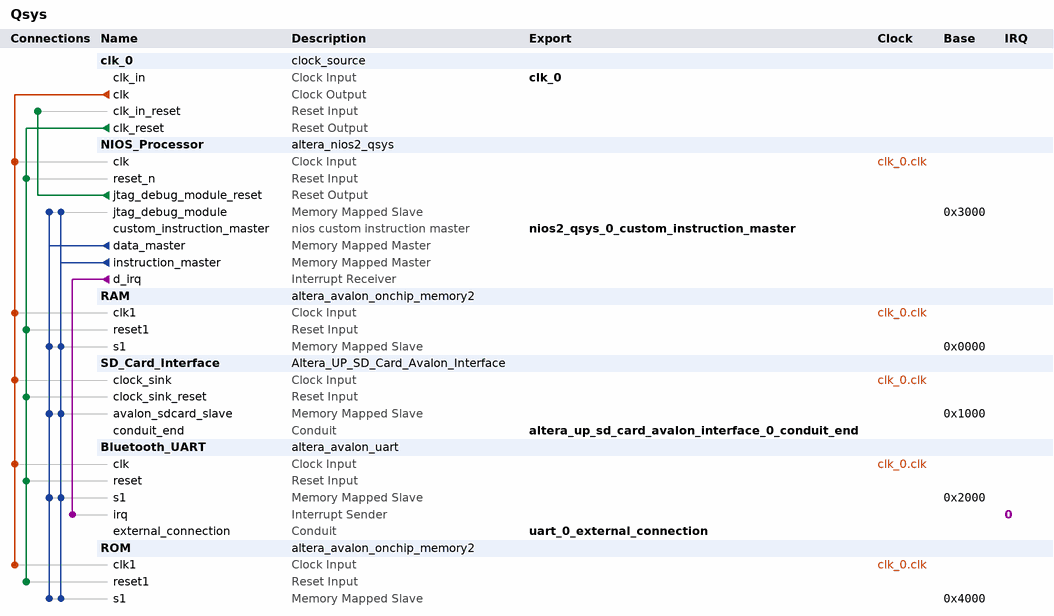
[diagram p0: system contents]
# Platform Designer (Qsys) system Qsys, Cyclone III EP3C25F256C6
# Parameters at their usual value, and those the tool derives, are not listed.
package require -exact qsys 13.0.1.99.2
create_system Qsys
set_project_property DEVICE_FAMILY {Cyclone III}
set_project_property DEVICE EP3C25F256C6

add_instance clk_0 clock_source 13.0
set_instance_parameter_value clk_0 clockFrequency 50000000

add_instance NIOS_Processor altera_nios2_qsys 13.0
set_instance_parameter_value NIOS_Processor setting_preciseIllegalMemAccessException true
set_instance_parameter_value NIOS_Processor setting_illegalInstructionsTrap true
set_instance_parameter_value NIOS_Processor setting_extraExceptionInfo true
set_instance_parameter_value NIOS_Processor resetSlave ROM.s1
set_instance_parameter_value NIOS_Processor mmu_TLBMissExcSlave None
set_instance_parameter_value NIOS_Processor exceptionSlave ROM.s1
set_instance_parameter_value NIOS_Processor breakSlave NIOS_Processor.jtag_debug_module
set_instance_parameter_value NIOS_Processor impl Small
set_instance_parameter_value NIOS_Processor icache_size 4096
set_instance_parameter_value NIOS_Processor debug_level Level2

add_instance RAM altera_avalon_onchip_memory2 13.0.1.99.2
set_instance_parameter_value RAM dataWidth 32
set_instance_parameter_value RAM dualPort false
set_instance_parameter_value RAM initMemContent true
set_instance_parameter_value RAM initializationFileName onchip_mem.hex
set_instance_parameter_value RAM memorySize 4096

add_instance SD_Card_Interface Altera_UP_SD_Card_Avalon_Interface 13.0

add_instance Bluetooth_UART altera_avalon_uart 13.0.1.99.2
set_instance_parameter_value Bluetooth_UART baud 19200
set_instance_parameter_value Bluetooth_UART dataBits 8
set_instance_parameter_value Bluetooth_UART fixedBaud true
set_instance_parameter_value Bluetooth_UART parity NONE
set_instance_parameter_value Bluetooth_UART stopBits 1

add_instance ROM altera_avalon_onchip_memory2 13.0.1.99.2
set_instance_parameter_value ROM dataWidth 32
set_instance_parameter_value ROM dualPort false
set_instance_parameter_value ROM initMemContent true
set_instance_parameter_value ROM initializationFileName onchip_mem.hex
set_instance_parameter_value ROM memorySize 4096
set_instance_parameter_value ROM writable false

# connections
add_connection clk_0.clk Bluetooth_UART.clk clock
add_connection clk_0.clk NIOS_Processor.clk clock
add_connection clk_0.clk RAM.clk1 clock
add_connection clk_0.clk ROM.clk1 clock
add_connection clk_0.clk SD_Card_Interface.clock_sink clock
add_connection clk_0.clk_reset Bluetooth_UART.reset reset
add_connection clk_0.clk_reset NIOS_Processor.reset_n reset
add_connection clk_0.clk_reset RAM.reset1 reset
add_connection clk_0.clk_reset ROM.reset1 reset
add_connection clk_0.clk_reset SD_Card_Interface.clock_sink_reset reset
add_connection NIOS_Processor.jtag_debug_module_reset clk_0.clk_in_reset reset
add_connection NIOS_Processor.data_master Bluetooth_UART.s1 avalon
set_connection_parameter_value NIOS_Processor.data_master/Bluetooth_UART.s1 baseAddress 0x2000
add_connection NIOS_Processor.data_master NIOS_Processor.jtag_debug_module avalon
set_connection_parameter_value NIOS_Processor.data_master/NIOS_Processor.jtag_debug_module baseAddress 0x3000
add_connection NIOS_Processor.data_master RAM.s1 avalon
set_connection_parameter_value NIOS_Processor.data_master/RAM.s1 baseAddress 0x0000
add_connection NIOS_Processor.data_master ROM.s1 avalon
set_connection_parameter_value NIOS_Processor.data_master/ROM.s1 baseAddress 0x4000
add_connection NIOS_Processor.data_master SD_Card_Interface.avalon_sdcard_slave avalon
set_connection_parameter_value NIOS_Processor.data_master/SD_Card_Interface.avalon_sdcard_slave baseAddress 0x1000
add_connection NIOS_Processor.instruction_master Bluetooth_UART.s1 avalon
set_connection_parameter_value NIOS_Processor.instruction_master/Bluetooth_UART.s1 baseAddress 0x2000
add_connection NIOS_Processor.instruction_master NIOS_Processor.jtag_debug_module avalon
set_connection_parameter_value NIOS_Processor.instruction_master/NIOS_Processor.jtag_debug_module baseAddress 0x3000
add_connection NIOS_Processor.instruction_master RAM.s1 avalon
set_connection_parameter_value NIOS_Processor.instruction_master/RAM.s1 baseAddress 0x0000
add_connection NIOS_Processor.instruction_master ROM.s1 avalon
set_connection_parameter_value NIOS_Processor.instruction_master/ROM.s1 baseAddress 0x4000
add_connection NIOS_Processor.instruction_master SD_Card_Interface.avalon_sdcard_slave avalon
set_connection_parameter_value NIOS_Processor.instruction_master/SD_Card_Interface.avalon_sdcard_slave baseAddress 0x1000
add_connection NIOS_Processor.d_irq Bluetooth_UART.irq interrupt
set_connection_parameter_value NIOS_Processor.d_irq/Bluetooth_UART.irq irqNumber 0

# exported interfaces
add_interface clk_0 clock sink
set_interface_property clk_0 EXPORT_OF clk_0.clk_in
add_interface nios2_qsys_0_custom_instruction_master nios_custom_instruction start
set_interface_property nios2_qsys_0_custom_instruction_master EXPORT_OF NIOS_Processor.custom_instruction_master
add_interface altera_up_sd_card_avalon_interface_0_conduit_end conduit end
set_interface_property altera_up_sd_card_avalon_interface_0_conduit_end EXPORT_OF SD_Card_Interface.conduit_end
add_interface uart_0_external_connection conduit end
set_interface_property uart_0_external_connection EXPORT_OF Bluetooth_UART.external_connection

set_interconnect_requirement {$system} qsys_mm.clockCrossingAdapter HANDSHAKE
set_interconnect_requirement {$system} qsys_mm.maxAdditionalLatency 1

save_system Qsys.qsys
